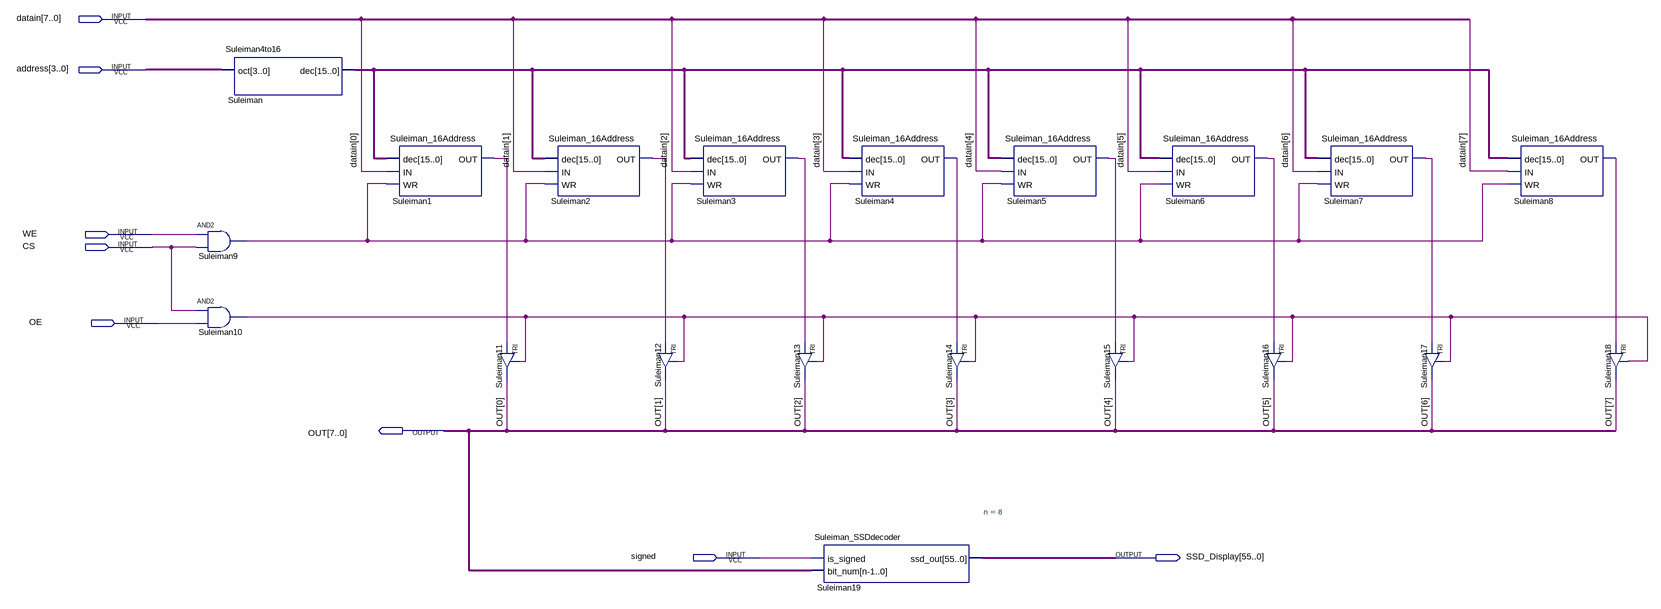
[diagram p0: schematic sheet]
// Quartus schematic Suleiman_16x8SRAM.bdf as structural Verilog: 20 symbols, 8 pins
module Suleiman_16x8SRAM (
  input  [7:0] datain,
  input  [3:0] address,
  input  WE,
  input  CS,
  input  OE,
  input  \signed ,
  output [7:0] OUT,
  output [55:0] SSD_Display
);

  wire Suleiman1_out, Suleiman2_out, Suleiman3_out, Suleiman4_out, Suleiman5_out, Suleiman6_out,
       Suleiman7_out, Suleiman8_out, Suleiman9_out, Suleiman10_out;
  wire [15:0] Suleiman_dec;

  Suleiman4to16 Suleiman (.oct(address), .dec(Suleiman_dec));
  and Suleiman9 (Suleiman9_out, WE, CS);
  and Suleiman10 (Suleiman10_out, CS, OE);
  Suleiman_16Address Suleiman1 (.dec(Suleiman_dec), .IN(datain[0]), .WR(Suleiman9_out), .OUT(Suleiman1_out));
  TRI Suleiman11 (.IN(Suleiman1_out), .OE(Suleiman10_out), .OUT(OUT[0]));
  Suleiman_16Address Suleiman2 (.dec(Suleiman_dec), .IN(datain[1]), .WR(Suleiman9_out), .OUT(Suleiman2_out));
  TRI Suleiman12 (.IN(Suleiman2_out), .OE(Suleiman10_out), .OUT(OUT[1]));
  Suleiman_16Address Suleiman3 (.dec(Suleiman_dec), .IN(datain[2]), .WR(Suleiman9_out), .OUT(Suleiman3_out));
  TRI Suleiman13 (.IN(Suleiman3_out), .OE(Suleiman10_out), .OUT(OUT[2]));
  Suleiman_SSDdecoder #(.n(8)) Suleiman19 (.is_signed(\signed ), .bit_num(OUT), .ssd_out(SSD_Display));
  Suleiman_16Address Suleiman4 (.dec(Suleiman_dec), .IN(datain[3]), .WR(Suleiman9_out), .OUT(Suleiman4_out));
  TRI Suleiman14 (.IN(Suleiman4_out), .OE(Suleiman10_out), .OUT(OUT[3]));
  Suleiman_16Address Suleiman5 (.dec(Suleiman_dec), .IN(datain[4]), .WR(Suleiman9_out), .OUT(Suleiman5_out));
  TRI Suleiman15 (.IN(Suleiman5_out), .OE(Suleiman10_out), .OUT(OUT[4]));
  Suleiman_16Address Suleiman6 (.dec(Suleiman_dec), .IN(datain[5]), .WR(Suleiman9_out), .OUT(Suleiman6_out));
  TRI Suleiman16 (.IN(Suleiman6_out), .OE(Suleiman10_out), .OUT(OUT[5]));
  Suleiman_16Address Suleiman7 (.dec(Suleiman_dec), .IN(datain[6]), .WR(Suleiman9_out), .OUT(Suleiman7_out));
  TRI Suleiman17 (.IN(Suleiman7_out), .OE(Suleiman10_out), .OUT(OUT[6]));
  Suleiman_16Address Suleiman8 (.dec(Suleiman_dec), .IN(datain[7]), .WR(Suleiman9_out), .OUT(Suleiman8_out));
  TRI Suleiman18 (.IN(Suleiman8_out), .OE(Suleiman10_out), .OUT(OUT[7]));
endmodule
